# EAGLE design GPSBee_v2 (EAGLE 7.1.0)
CNAME: GPSBee LEA6T; CREVISION: 1.0; DESIGNER: Tisham Dhar
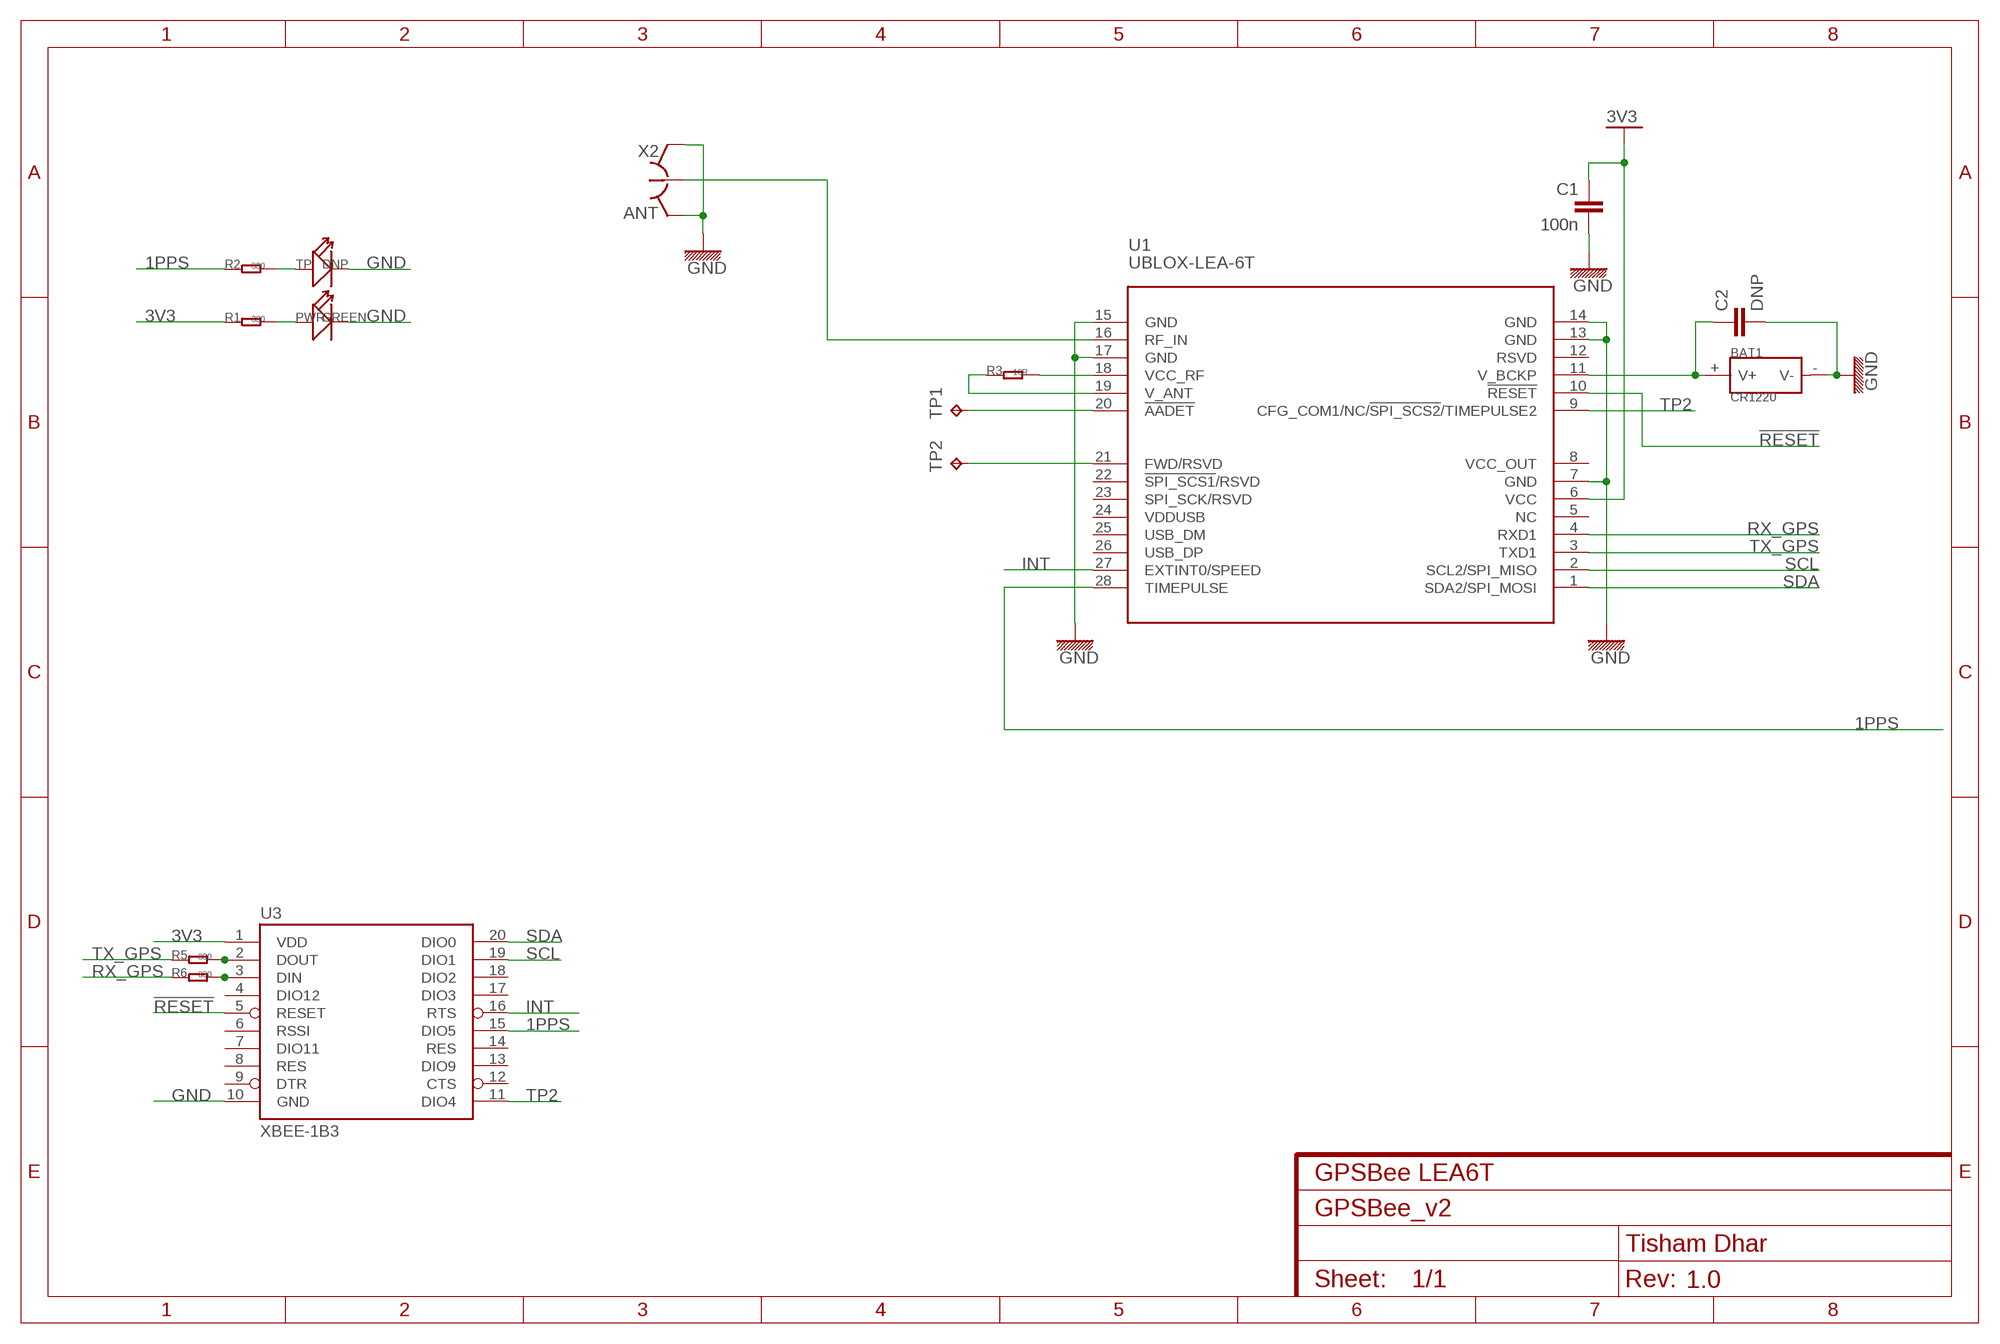
[diagram p0: schematic, sheet 1]

## Parts
BAT1  CR1220  BAT-HOLDER-SMD-1220  [PLASTIC-CR1220-L15.06XW13.0XH4.1MM]
C1  100n  C-EU_0603  [0603]
C2  DNP  C-EU_0603  [0603]
PWR  GREEN  LED'0603'  [LED-0603]
R1  330  R-0603  [0603]
R2  330  R-0603  [0603]
R3  10R  R-0603  [0603]
R5  330  R-0603  [0603]
R6  330  R-0603  [0603]
TP  DNP  LED'0603'  [LED-0603]
TP1  TPTP10R  [TP10R]
TP2  TPTP10R  [TP10R]
U1  UBLOX-LEA-6T  [UBLOX-LEA-6]
U3  XBEE-1B3  [XBEE-SMD]
X2  ANT  HRS_UFL  [HRS_UFL]

## Nets
1PPS: R2.1 U1.28(TIMEPULSE) U3.15(DIO5)
3V3: C1.1 R1.1 U1.6(VCC) U3.1(VDD)
!RESET: U1.10(!RESET) U3.5(RESET)
GND: BAT1.-(V-) C1.2 C2.2 PWR.- TP.- U1.7(GND) U1.13(GND) U1.14(GND) U1.15(GND) U1.17(GND) U3.10(GND) X2.GND@1(GND) X2.GND@2(GND)
INT: U1.27(EXTINT0/SPEED) U3.16(RTS)
N$1: PWR.+ R1.2
N$2: R6.2 U3.3(DIN)
N$3: TP1.TP U1.20(!AADET)
N$4: R5.2 U3.2(DOUT)
N$5: R2.2 TP.+
N$6: TP2.TP U1.21(FWD/RSVD)
N$15: R3.2 U1.18(VCC_RF)
N$16: R3.1 U1.19(V_ANT)
N$21: BAT1.+(V+) C2.1 U1.11(V_BCKP)
N$26: U1.16(RF_IN) X2.SIG
RX_GPS: R6.1 U1.4(RXD1)
SCL: U1.2(SCL2/SPI_MISO) U3.19(DIO1)
SDA: U1.1(SDA2/SPI_MOSI) U3.20(DIO0)
TP2: U1.9(CFG_COM1/NC/!SPI_SCS2!/TIMEPULSE2) U3.11(DIO4)
TX_GPS: R5.1 U1.3(TXD1)
Unconnected: U1.5(NC) U1.12(RSVD) U1.22(!SPI_SCS1!/RSVD) U1.23(SPI_SCK/RSVD) U1.25(USB_DM) U1.26(USB_DP) U3.4(DIO12) U3.6(RSSI) U3.7(DIO11) U3.8(RES) U3.9(DTR) U3.12(CTS) U3.13(DIO9) U3.14(RES) U3.17(DIO3) U3.18(DIO2)

## Power pins joined to a net without a drawn wire
VCC_OUT: U1.8(VCC_OUT)
VDDUSB: U1.24(VDDUSB)

## Library data of the parts
BAT1 = Connector:BAT-HOLDER: METAL-CR1220-D13.5*H5.0MM:320170002;METAL-CR1632-SMD:320170007;METAL-CR2032-D20.0*H6.3MM:320170003;METAL-CR2032-SMD:320170006;PLASTIC-CR1220-L15.06*W13.0*H4.1MM:320170000;PLASTIC-CR2032-L25.2*W15.6*H5.2MM:320170005
C1 C2 = we_passive:C-EU: Capacitor
PWR TP = Discrete:LED*
R1-R3 R5 R6 = Discrete:R*
TP1 TP2 = testpad:TP: Test pad
U1 = we_chips:UBLOX-LEA-6: u-blox GPS modules LEA-6 line Various models LEA-6A, LEA-6S, LEA-6H, LEA-6T, LEA-6R See the datasheet for the various pin configuration depending on the model.
U3 = SparkFun-RF:XBEE-1: Xbee module footprints SMT header is CONN-09042.; PROD_ID: CONN-09042
X2 = we_conn:HRS_UFL: Hirose U.FL SMT

## Net classes
0 default: width 0.003 mm, drill 0.254 mm, clearance 0.152 mm

## Board
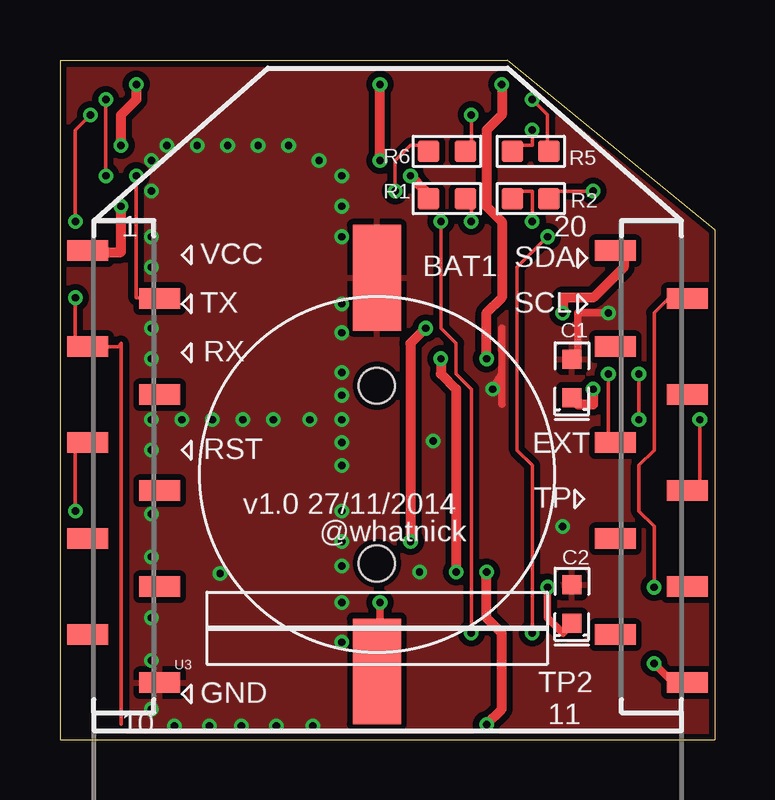
[diagram p1: board, top side]
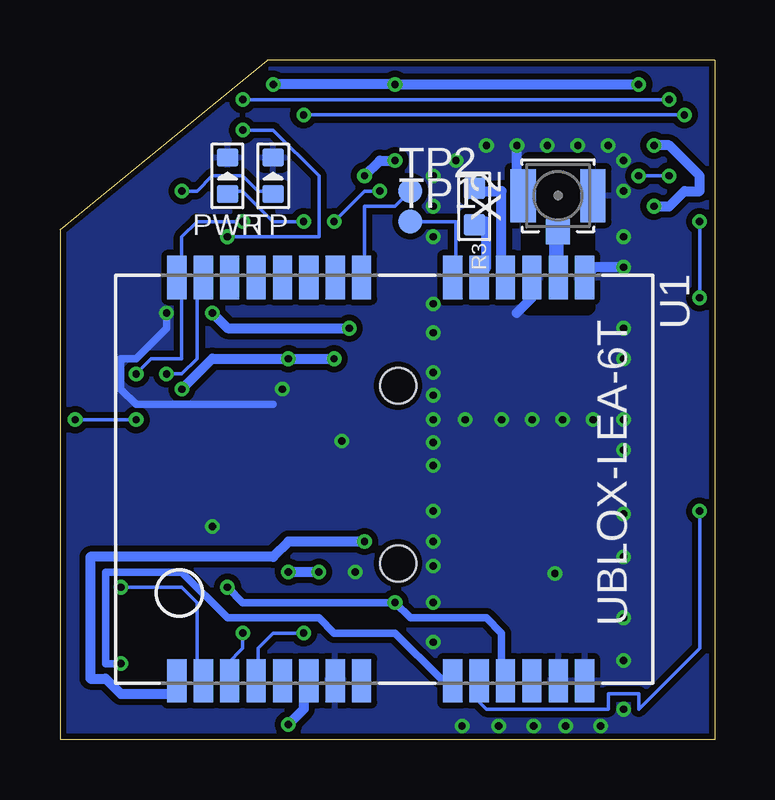
[diagram p2: board, bottom side, seen from below]

Size 27.31 x 28.32 mm. Coordinates in mm from the lower left corner, seen from the top.
Outline: 18.65,28.32 27.31,21.25 27.31,0 0,0 0,28.32 18.65,28.32
Outline: 18.65,28.32 18.68,28.32
Copper layers (1*16): Top 0.035mm / dielectric 1.5mm / Bottom 0.035mm
Design rules "SeeedStudio_2layer_DRU_no_angle_20140221": minimum track width 6mil, minimum drill 12mil, track to track 6mil, track to pad 6mil, pad to pad 6mil, via to via 6mil, smd to smd 0mil, copper to edge 10mil, drill to drill 10mil, minimum pad ring 10mil, minimum via ring 6mil, stop-mask expansion 2mil, vias tented up to drill 100mil, thermal gap 10mil
bRestrict: 4 lines

### Footprints (pad centres in the part's own frame; a part is rotated, then mirrored left to right if it is on the bottom)
PLASTIC-CR1220-L15.06XW13.0XH4.1MM = smd 2 x 4.4: + 0,-8.2; - 0,8.2 | hole 1.5: 0,3.7; 0,-3.7
0603 = smd 0.8 x 0.8: 1 -0.8,0; 2 0.8,0
LED-0603 = smd 0.762 x 0.889: + -0.762,0; - 0.762,0
0603' = smd 0.889 x 0.889: 1 -0.762,0; 2 0.762,0
TP10R = smd 1 x 1: TP 0,0
UBLOX-LEA-6 = smd 1.8 x 0.8: 1 8.4,-8.65; 2 8.4,-7.55; 3 8.4,-6.45; 4 8.4,-5.35; 5 8.4,-4.25; 6 8.4,-3.15; 7 8.4,-2.05; 8 8.4,-0.95; 9 8.4,2.85; 10 8.4,3.95; 11 8.4,5.05; 12 8.4,6.15; 13 8.4,7.25; 14 8.4,8.35; 15 -8.4,8.35; 16 -8.4,7.25; 17 -8.4,6.15; 18 -8.4,5.05; 19 -8.4,3.95; 20 -8.4,2.85; 21 -8.4,-0.95; 22 -8.4,-2.05; 23 -8.4,-3.15; 24 -8.4,-4.25; 25 -8.4,-5.35; 26 -8.4,-6.45; 27 -8.4,-7.55; 28 -8.4,-8.65
XBEE-SMD = smd 1.7 x 0.85: 1 -12.5,20; 2 -9.5,18; 3 -12.5,16; 4 -9.5,14; 5 -12.5,12; 6 -9.5,10; 7 -12.5,8; 8 -9.5,6; 9 -12.5,4; 10 -9.5,2; 11 12.5,2; 12 9.5,4; 13 12.5,6; 14 9.5,8; 15 12.5,10; 16 9.5,12; 17 12.5,14; 18 9.5,16; 19 12.5,18; 20 9.5,20
HRS_UFL = smd 1.05 x 2.2: GND@1 -1.452,0; GND@2 1.452,0 | smd 1 x 1.05: SIG 0,-1.502

### Placement (x,y rotation side)
BAT1  13.22,11.05 0 top
C1  21.34,15.05 90 top
C2  21.34,5.65 90 top
PWR  20.33,23.5 90 bottom
R1  330  [0603']  16.14,22.54 0 top
R2  330  [0603']  19.63,22.54 0 top
R3  10R  [0603']  10.04,22.23 90 bottom
R5  330  [0603']  19.63,24.51 0 top
R6  330  [0603']  16.14,24.51 0 top
TP  18.42,23.5 90 bottom
TP1  12.71,21.59 0 bottom
TP2  12.71,22.86 0 bottom
U1  13.79,10.86 270 bottom
U3  13.66,0.38 0 top
X2  6.55,22.67 0 bottom

### Tracks (layer width: path | path; a pad name or v marks a point on that pad's centre or on a via)
1PPS  (via drill 0.3)
  Top 0.152: v24.14,13.34 v24.14,15.24 | v26.68,13.34 26.68,10.79 U3.15 | R2.1 19.06,22.86 19.69,22.86 v19.69,21.59
  Bottom 0.152: v26.68,13.34 v24.14,13.34 | v24.14,15.24 23.5,15.88 22.23,15.88 22.23,19.05 U1.28 22.23,19.68 22.23,20.95 21.6,21.59 v19.69,21.59
3V3  (via drill 0.3)
  Top 0.406: v3.18,27.3 3.18,26.67 2.55,26.04 v2.55,24.77 | v13.34,24.13 v13.34,27.3 | v14.61,23.5 15.25,22.86 R1.1 | v2.55,22.23 2.55,20.32 1.28,20.32 U3.1 | v18.42,27.3 18.42,26.04 17.79,25.4 17.79,22.23 18.42,21.59 18.42,18.41 17.79,17.78 v17.79,15.88 | v22.23,14.61 22.23,13.97 21.6,13.97 C1.1 | v17.79,6.99 17.79,5.08 18.42,4.45 18.42,1.27 v17.79,0.64 | v16.52,6.99 16.52,14.61 15.88,15.24 v15.88,15.88
  Bottom 0.406: v3.18,27.3 v13.34,27.3 v18.42,27.3 | v13.34,24.13 13.98,24.13 v14.61,23.5 | v2.55,24.77 1.91,24.77 0.64,23.5 0.64,22.86 1.28,22.86 1.91,22.23 v2.55,22.23 | v22.23,14.61 20.96,15.88 v17.79,15.88 v15.88,15.88 | v17.79,0.64 17.15,1.27 17.15,1.91 U1.6 | v16.52,6.99 v17.79,6.99
!RESET  (via drill 0.3)
  Top 0.152: v0.64,9.53 0.64,12.06 U3.5
  Bottom 0.152: U1.10 10.17,1.91 9.53,1.27 4.45,1.27 4.45,1.91 3.18,1.91 3.18,1.27 0.64,3.81 v0.64,9.53
GND  (via drill 0.3)
  Top 0.305: 18.42,15.24 18.42,17.14 | v18.04,14.61 18.42,15.24 | 18.42,13.97 18.42,15.24 | v22.87,17.78 21.6,17.78 21.6,15.88 C1.2
  Bottom 0.152: 8.26,22.86 X2.GND@1
  Bottom 0.305: 18.42,13.97 24.14,13.97 24.77,14.61 24.77,15.88 24.14,15.88 22.87,17.14 v22.87,17.78
  Bottom 0.406: v3.82,19.68 5.01,19.68 U1.15 | U1.17 7.64,18.41 8.26,17.78 | 8.26,22.86 v8.26,24.77
  other vias: 3.82,22.86 3.82,20.95 3.82,17.14 3.82,15.88 3.82,13.34 3.82,12.06 3.82,9.4 3.82,7.62 3.82,5.08 3.82,3.3 3.82,1.27 4.77,0.57 6.23,0.57 7.56,0.57 9.02,0.57 10.55,0.57 11.75,4.06 11.75,5.71 6.67,6.92 11.75,8.26 11.75,9.53 11.75,11.43 11.75,13.34 11.75,15.3 11.75,16.95 11.75,18.16 11.75,20.95 9.53,24.77 6.99,24.77 5.72,24.77 10.8,24.13 11.75,23.5 11.75,22.23 11.75,12.38 11.75,14.35 4.45,24.77 3.82,24.13 20.96,8.89 15.56,12.45 14.99,6.99 5.09,13.34 6.36,13.34 7.63,13.34 8.9,13.34 10.42,13.34 11.75,7.24
  pour Bottom (isolate 0.254): 0.01,27.94 27.31,27.94 27.31,0 0.01,0
  pour Top (isolate 0.254): 0.01,27.94 27.31,27.94 27.31,0 0.01,0
INT  (via drill 0.3)
  Top 0.152: U3.16 22.87,12.7 v22.87,15.24
  Bottom 0.152: v22.87,15.24 22.23,15.24 21.6,15.88 21.6,19.05 U1.27
N$1  (via drill 0.3)
  Top 0.152: v17.15,21.59 17.15,22.23 R1.2
  Bottom 0.152: v17.15,21.59 18.42,21.59 19.69,22.86 20.33,22.86 PWR.+
N$2  (via drill 0.3)
  Top 0.152: 2.55,0.64 2.55,16.51 2.42,16.38 U3.3 0.64,16.51 v0.64,18.41 | v17.15,26.04 17.15,24.77 R6.2 | v1.28,26.04 0.64,25.4 v0.64,21.59
  Bottom 0.152: v17.15,26.04 v1.28,26.04 | v0.64,18.41 v0.64,21.59
N$3
  Bottom 0.152: 10.8,19.05 U1.20 10.8,19.68 10.8,21.59 TP1.TP
N$4  (via drill 0.3)
  Top 0.152: v19.69,26.67 20.33,26.04 20.33,24.77 R5.2 | v1.91,23.5 v1.91,26.67 | v3.18,23.5 3.18,18.41 3.82,18.41 U3.2
  Bottom 0.152: v19.69,26.67 v1.91,26.67 | v3.18,23.5 v1.91,23.5
N$5  (via drill 0.3)
  Top 0.152: v22.23,22.86 20.33,22.86 R2.2
  Bottom 0.152: TP.+ 18.42,22.86 19.06,22.86 19.69,23.5 20.96,23.5 21.6,22.86 v22.23,22.86
N$6
  Bottom 0.152: TP2.TP 13.34,22.23 14.61,22.23 14.61,19.68 U1.21
N$15
  Bottom 0.406: R3.2 10.17,22.86 8.9,22.86 8.9,19.68 U1.18
N$16
  Bottom 0.406: R3.1 10.17,21.59 9.53,21.59 9.53,19.68 U1.19
N$21  (via drill 0.3)
  Top 0.305: v13.34,5.71 13.34,3.17 BAT1.+ | v20.33,6.35 20.33,5.08 20.96,4.45 21.6,5.08 C2.1
  Bottom 0.305: U1.11 8.9,2.54 8.9,4.45 9.53,5.08 12.71,5.08 v13.34,5.71 19.69,5.71 v20.33,6.35
N$26
  Bottom 0.305: 6.61,19.75 U1.16 | 6.61,21.02 X2.SIG
  Bottom 0.61: 6.61,21.02 6.61,19.75
RX_GPS  (via drill 0.3)
  Top 0.152: v15.88,21.59 15.88,17.14 16.52,16.51 16.52,15.24 17.15,14.61 v17.15,4.45 | v13.98,22.86 13.98,24.13 14.61,24.77 15.25,24.77 R6.1
  Bottom 0.152: v15.88,21.59 14.61,22.86 v13.98,22.86 | v17.15,4.45 18.42,4.45 19.06,3.81 19.06,2.54 U1.4
SCL  (via drill 0.3)
  Top 0.152: U3.19 26.04,18.41 25.41,18.41 24.77,17.78 24.77,12.06 24.14,11.43 24.14,9.53 24.77,8.89 v24.77,6.35
  Bottom 0.152: v24.77,6.35 22.23,6.35 21.6,5.71 21.6,2.54 U1.2
SDA  (via drill 0.3)
  Top 0.406: v14.61,8.26 14.61,16.51 v15.25,17.14 | v20.96,17.78 20.96,18.41 22.23,18.41 23.5,19.68 23.5,20.32 U3.20
  Bottom 0.406: v14.61,8.26 17.79,8.26 18.42,7.62 26.04,7.62 26.04,2.54 25.41,2.54 24.77,1.91 22.23,1.91 U1.1 | v15.25,17.14 20.33,17.14 v20.96,17.78
TP2  (via drill 0.3)
  Top 0.305: v24.77,3.17 25.41,2.54 26.04,2.54 U3.11
  Bottom 0.305: U1.9 10.8,2.54 11.44,2.54 13.34,4.45 15.88,4.45 16.52,5.08 20.33,5.08 22.23,6.99 25.41,6.99 25.41,3.17 v24.77,3.17
TX_GPS  (via drill 0.3)
  Top 0.152: R5.1 19.06,24.77 19.69,24.77 v19.69,25.4 | v19.69,4.45 19.69,11.43 19.06,12.06 19.06,19.68 v20.33,20.95
  Bottom 0.152: v19.69,4.45 19.69,3.81 20.33,3.17 20.33,2.54 U1.3 | v19.69,25.4 18.42,25.4 16.52,23.5 16.52,20.95 v20.33,20.95

### Text on the board
tPlace: 1 | 20 | VCC | SDA | TX | SCL | RX | RST | EXT | TP | v1.0 27/11/2014 | @whatnick | GND | TP2 | 11 | 10